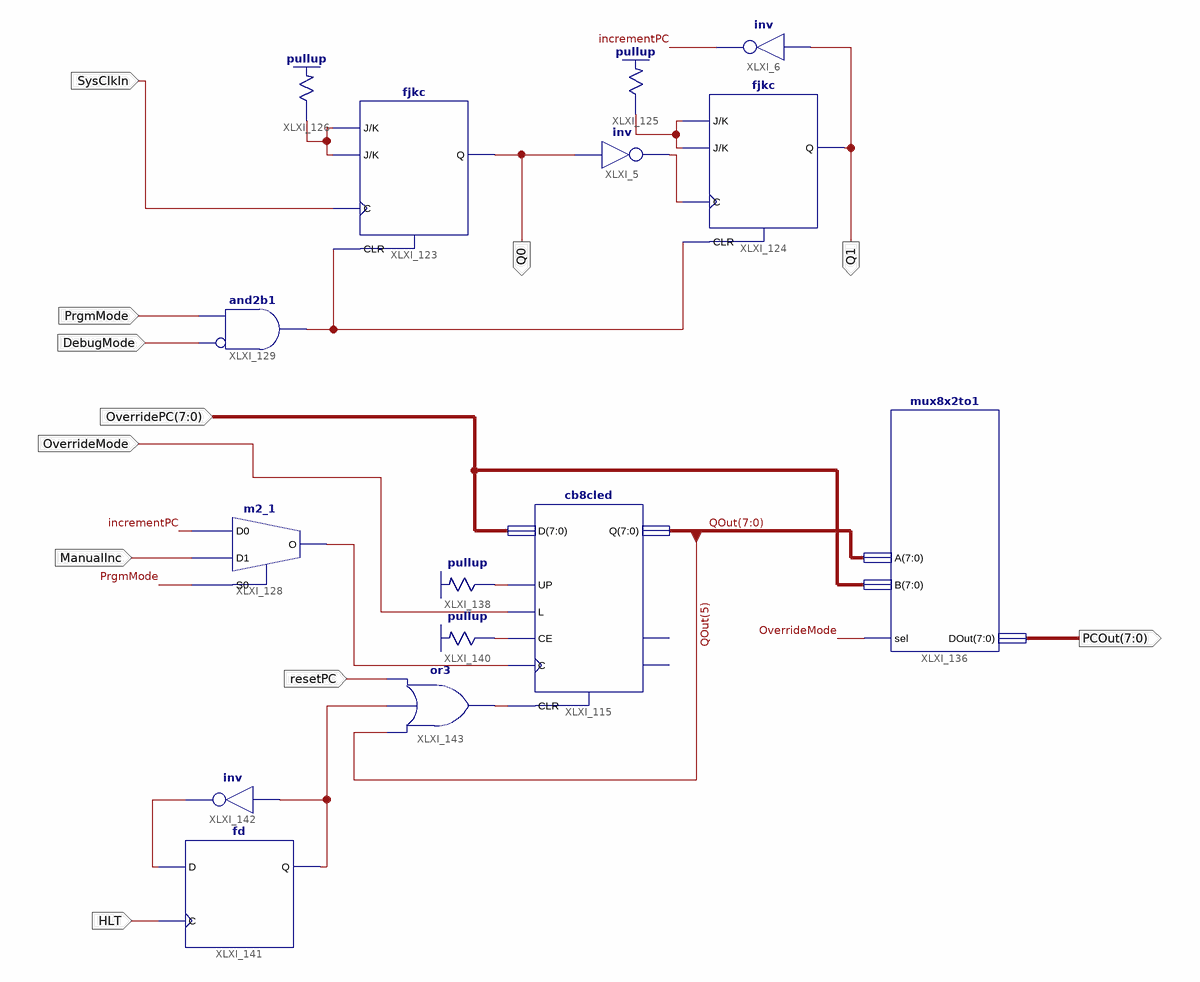
[diagram p0: schematic sheet 1]
// Xilinx ISE schematic ProgramCounter.sch (spartan3e) as structural Verilog: 15 symbols, 11 ports
module ProgramCounter (
  input  SysClkIn,
  input  PrgmMode,
  input  ManualInc,
  input  DebugMode,
  input  [7:0] OverridePC,
  input  OverrideMode,
  input  HLT,
  input  resetPC,
  output Q0,
  output Q1,
  output [7:0] PCOut
);

  wire incrementPC, notQ0, XLXN_6, XLXN_17, XLXN_18, XLXN_31, XLXN_39, XLXN_41, XLXN_42, XLXN_45, XLXN_51;
  wire [7:0] QOut;

  not XLXI_5 (notQ0, Q0);
  not XLXI_6 (incrementPC, Q1);
  cb8cled XLXI_115 (
    .C(XLXN_39), .CE(XLXN_42), .CLR(XLXN_6), .D(OverridePC), .L(OverrideMode), .UP(XLXN_41), .Q(QOut));  // open: CEO, TC
  fjkc XLXI_123 (.C(SysClkIn), .CLR(XLXN_31), .J(XLXN_18), .K(XLXN_18), .Q(Q0));
  fjkc XLXI_124 (.C(notQ0), .CLR(XLXN_31), .J(XLXN_17), .K(XLXN_17), .Q(Q1));
  \pullup  XLXI_125 (.O(XLXN_17));
  \pullup  XLXI_126 (.O(XLXN_18));
  m2_1 XLXI_128 (.D0(incrementPC), .D1(ManualInc), .S0(PrgmMode), .O(XLXN_39));
  and XLXI_129 (XLXN_31, ~DebugMode, PrgmMode);  // and2b1
  mux8x2to1 XLXI_136 (.A(QOut), .B(OverridePC), .sel(OverrideMode), .DOut(PCOut));
  \pullup  XLXI_138 (.O(XLXN_41));
  \pullup  XLXI_140 (.O(XLXN_42));
  fd XLXI_141 (.C(HLT), .D(XLXN_45), .Q(XLXN_51));
  not XLXI_142 (XLXN_45, XLXN_51);
  or XLXI_143 (XLXN_6, QOut[5], XLXN_51, resetPC);
endmodule
